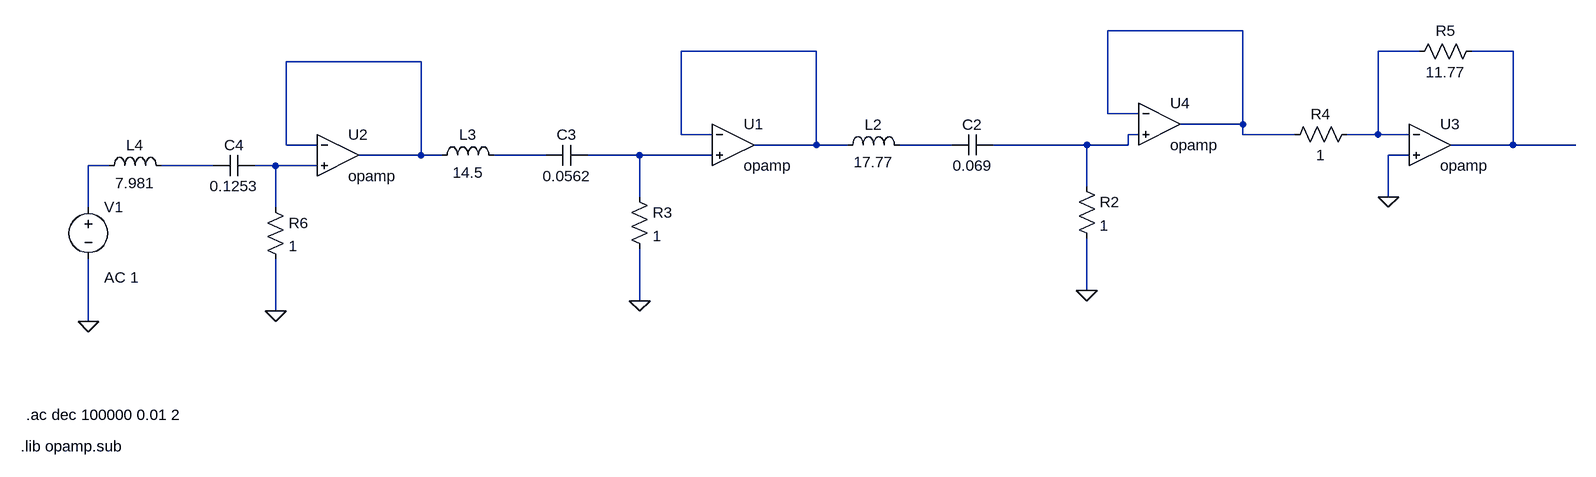
[diagram p0: schematic pasabanda_rlc_norm.asc]
pasabanda_rlc_norm.asc, the LTspice schematic file:
Version 4
SHEET 1 4580 1076
WIRE 2688 -48 2480 -48
WIRE 2032 -16 1824 -16
WIRE 2960 -16 2896 -16
WIRE 3104 -16 3040 -16
WIRE 1424 0 1216 0
WIRE 2480 80 2480 -48
WIRE 2528 80 2480 80
WIRE 2688 96 2688 -48
WIRE 2688 96 2592 96
WIRE 1824 112 1824 -16
WIRE 1872 112 1824 112
WIRE 2528 112 2512 112
WIRE 2688 112 2688 96
WIRE 2768 112 2688 112
WIRE 2896 112 2896 -16
WIRE 2896 112 2848 112
WIRE 2944 112 2896 112
WIRE 1216 128 1216 0
WIRE 1264 128 1216 128
WIRE 2032 128 2032 -16
WIRE 2032 128 1936 128
WIRE 2080 128 2032 128
WIRE 2240 128 2160 128
WIRE 2448 128 2304 128
WIRE 2512 128 2512 112
WIRE 2512 128 2448 128
WIRE 3104 128 3104 -16
WIRE 3104 128 3008 128
WIRE 3200 128 3104 128
WIRE 1424 144 1424 0
WIRE 1424 144 1328 144
WIRE 1456 144 1424 144
WIRE 1616 144 1536 144
WIRE 1760 144 1680 144
WIRE 1872 144 1760 144
WIRE 2944 144 2912 144
WIRE 944 160 912 160
WIRE 1104 160 1024 160
WIRE 1200 160 1168 160
WIRE 1264 160 1200 160
WIRE 2448 192 2448 128
WIRE 1760 208 1760 144
WIRE 2912 208 2912 144
WIRE 912 224 912 160
WIRE 1200 224 1200 160
WIRE 2448 352 2448 272
WIRE 1760 368 1760 288
WIRE 1200 384 1200 304
WIRE 912 400 912 304
FLAG 912 400 0
FLAG 2912 208 0
FLAG 2448 352 0
FLAG 1760 368 0
FLAG 1200 384 0
SYMBOL voltage 912 208 R0
WINDOW 123 24 124 Left 2
WINDOW 39 0 0 Left 0
SYMATTR Value2 AC 1
SYMATTR InstName V1
SYMATTR Value ""
SYMBOL ind 2064 144 R270
WINDOW 0 32 56 VTop 2
WINDOW 3 5 56 VBottom 2
SYMATTR InstName L2
SYMATTR Value 17.77
SYMBOL cap 2304 112 R90
WINDOW 0 0 32 VBottom 2
WINDOW 3 32 32 VTop 2
SYMATTR InstName C2
SYMATTR Value 0.069
SYMBOL res 2432 176 R0
SYMATTR InstName R2
SYMATTR Value 1
SYMBOL OpAmps\\opamp 1296 80 R0
SYMATTR InstName U2
SYMBOL ind 1440 160 R270
WINDOW 0 32 56 VTop 2
WINDOW 3 5 56 VBottom 2
SYMATTR InstName L3
SYMATTR Value 14.5
SYMBOL cap 1680 128 R90
WINDOW 0 0 32 VBottom 2
WINDOW 3 32 32 VTop 2
SYMATTR InstName C3
SYMATTR Value 0.0562
SYMBOL res 1744 192 R0
SYMATTR InstName R3
SYMATTR Value 1
SYMBOL OpAmps\\opamp 2976 64 R0
SYMATTR InstName U3
SYMBOL res 2864 96 R90
WINDOW 0 0 56 VBottom 2
WINDOW 3 32 56 VTop 2
SYMATTR InstName R4
SYMATTR Value 1
SYMBOL res 3056 -32 R90
WINDOW 0 0 56 VBottom 2
WINDOW 3 32 56 VTop 2
SYMATTR InstName R5
SYMATTR Value 11.77
SYMBOL ind 928 176 R270
WINDOW 0 32 56 VTop 2
WINDOW 3 5 56 VBottom 2
SYMATTR InstName L4
SYMATTR Value 7.981
SYMBOL cap 1168 144 R90
WINDOW 0 0 32 VBottom 2
WINDOW 3 32 32 VTop 2
SYMATTR InstName C4
SYMATTR Value 0.1253
SYMBOL res 1184 208 R0
SYMATTR InstName R6
SYMATTR Value 1
SYMBOL OpAmps\\opamp 1904 64 R0
SYMATTR InstName U1
SYMBOL OpAmps\\opamp 2560 32 R0
SYMATTR InstName U4
TEXT 808 592 Left 2 !.lib opamp.sub
TEXT 816 544 Left 2 !.ac dec 100000 0.01 2

The netlist it stands for:
* pasabanda_rlc_norm.asc
V1 N010 0 AC 1
L2 N002 N007 17.77
C2 N006 N007 0.069
R2 N006 0 1
XU2 N005 N012 N005 opamp Aol=100K GBW=10Meg  ; pins invin noninvin out
L3 N005 N008 14.5
C3 N009 N008 0.0562
R3 N009 0 1
XU3 N003 0 N004 opamp Aol=100K GBW=10Meg  ; pins invin noninvin out
R4 N003 N001 1
R5 N004 N003 11.77
L4 N010 N011 7.981
C4 N012 N011 0.1253
R6 N012 0 1
XU1 N002 N009 N002 opamp Aol=100K GBW=10Meg  ; pins invin noninvin out
XU4 N001 N006 N001 opamp Aol=100K GBW=10Meg  ; pins invin noninvin out
.lib opamp.sub
.ac dec 100000 0.01 2
.backanno
.end